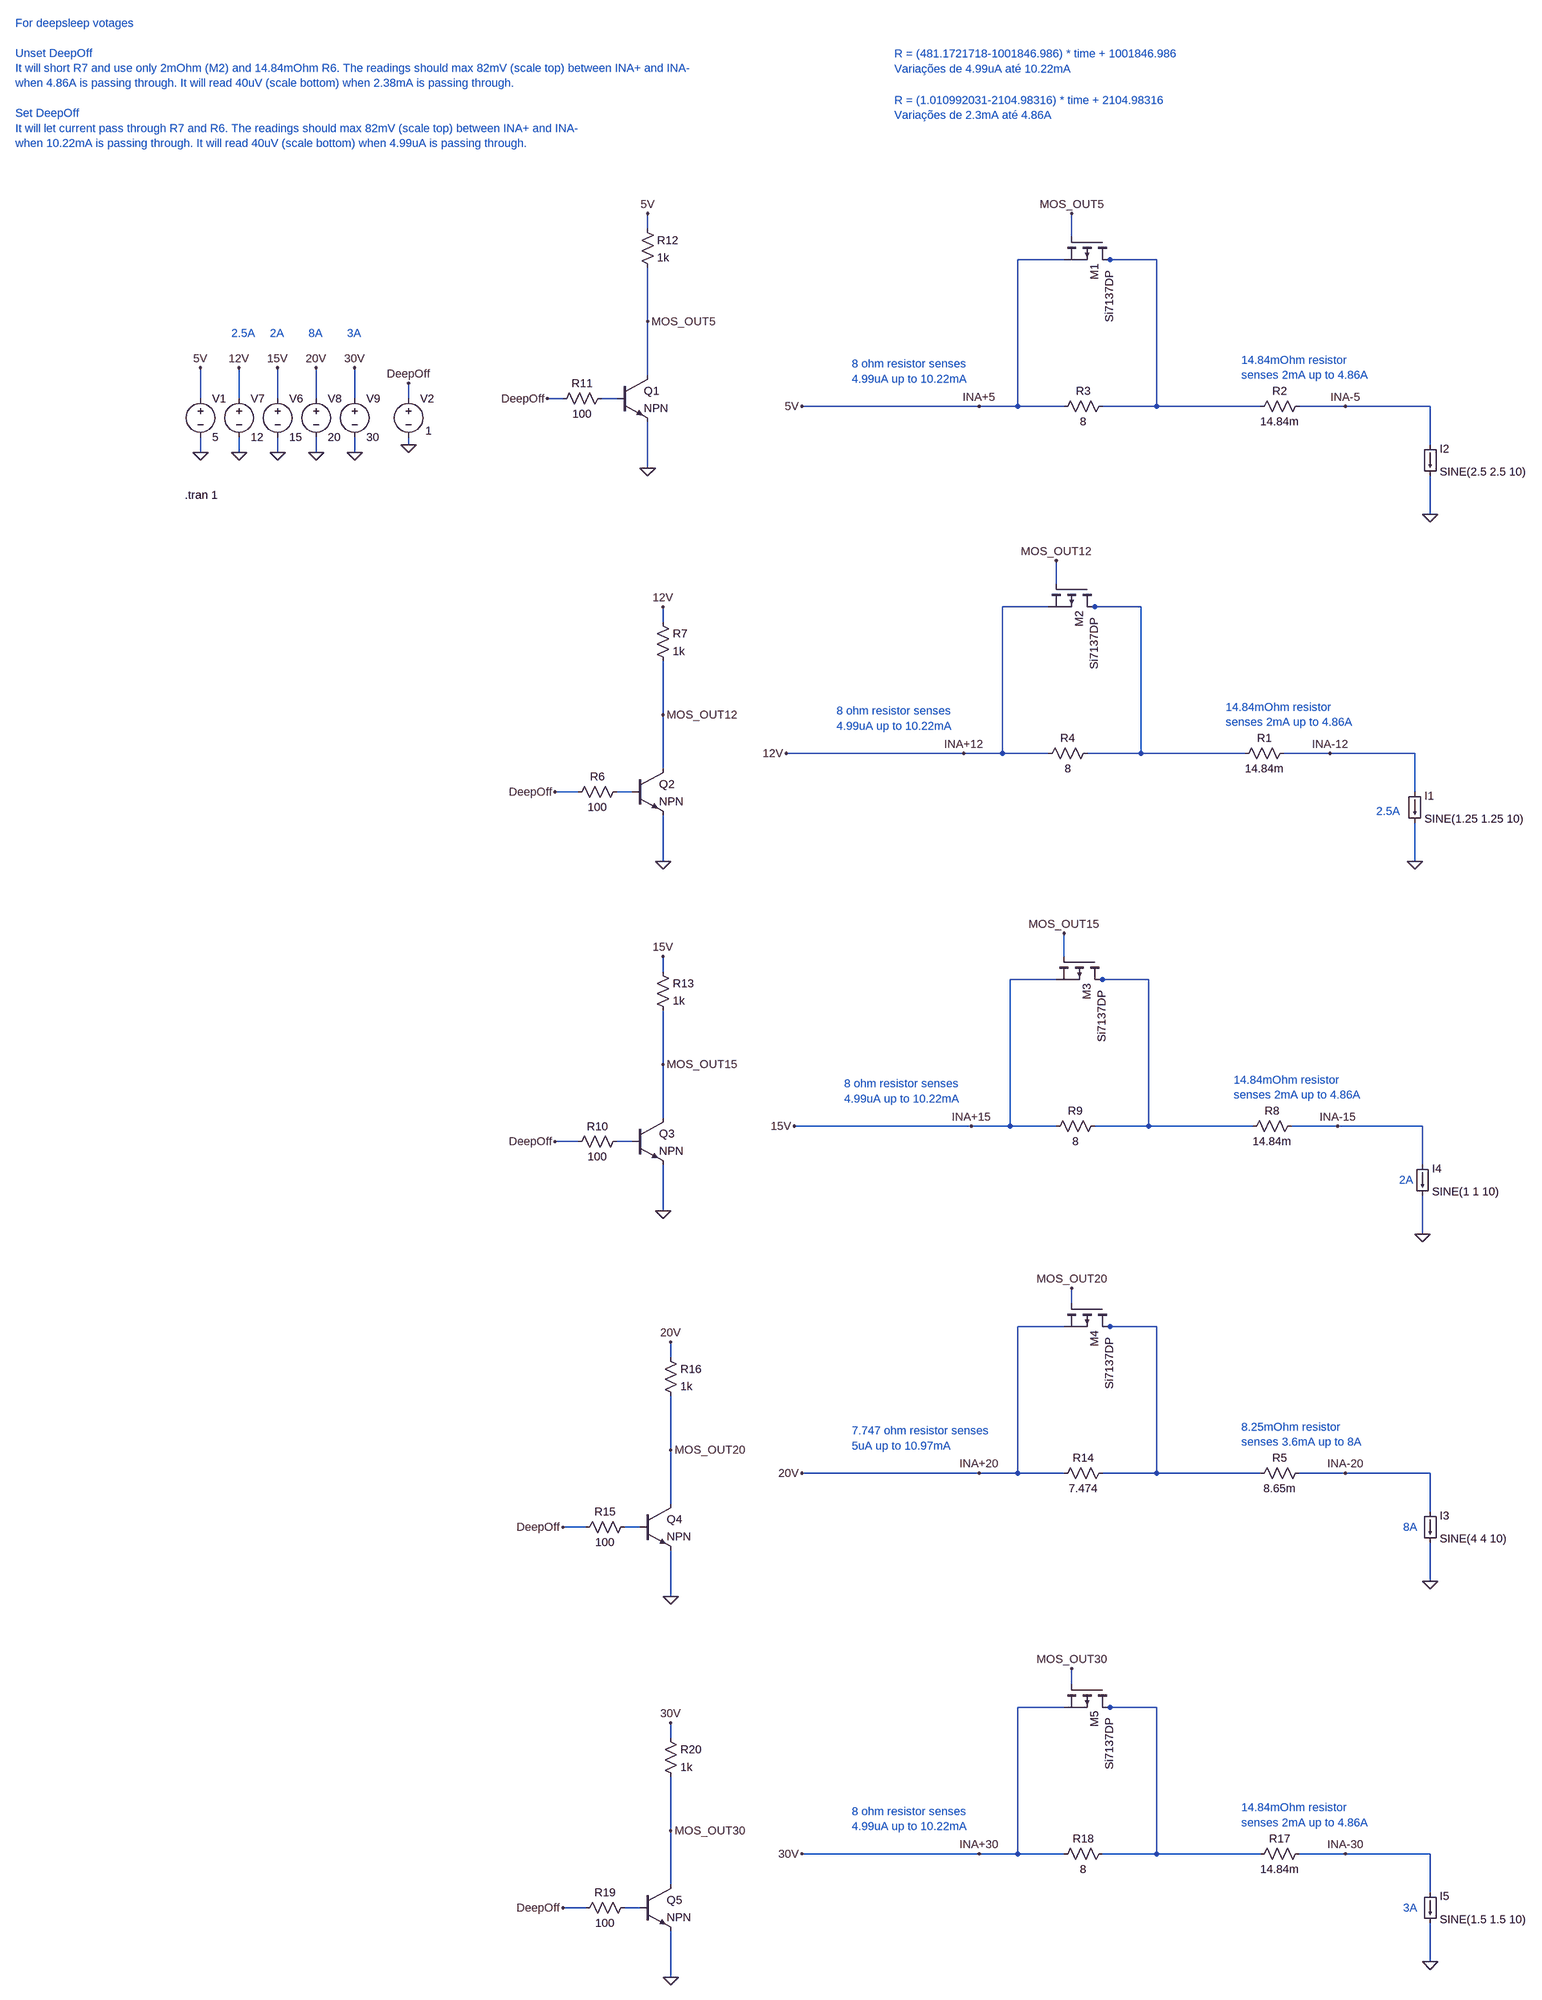
[diagram p0: schematic auto_ranging.asc]
auto_ranging.asc, the LTspice schematic file:
Version 4.1
SHEET 1 1712 4932
WIRE -1104 288 -1104 256
WIRE -224 304 -224 256
WIRE -240 352 -336 352
WIRE -144 352 -160 352
WIRE -48 352 -144 352
WIRE -1104 480 -1104 368
WIRE -1104 592 -1104 480
WIRE -2032 640 -2032 576
WIRE -1952 640 -1952 576
WIRE -1872 640 -1872 576
WIRE -1792 640 -1792 576
WIRE -1712 640 -1712 576
WIRE -1600 640 -1600 608
WIRE -1280 640 -1312 640
WIRE -1168 640 -1200 640
WIRE -416 656 -784 656
WIRE -336 656 -336 352
WIRE -336 656 -416 656
WIRE -240 656 -336 656
WIRE -48 656 -48 352
WIRE -48 656 -160 656
WIRE 208 656 -48 656
WIRE 384 656 288 656
WIRE 560 656 384 656
WIRE -1600 736 -1600 720
WIRE 560 736 560 656
WIRE -2032 752 -2032 720
WIRE -1952 752 -1952 720
WIRE -1872 752 -1872 720
WIRE -1792 752 -1792 720
WIRE -1712 752 -1712 720
WIRE -1104 784 -1104 688
WIRE 560 880 560 800
WIRE -256 1024 -256 976
WIRE -272 1072 -368 1072
WIRE -176 1072 -192 1072
WIRE -80 1072 -176 1072
WIRE -1072 1104 -1072 1072
WIRE -1072 1296 -1072 1184
WIRE -448 1376 -816 1376
WIRE -368 1376 -368 1072
WIRE -368 1376 -448 1376
WIRE -272 1376 -368 1376
WIRE -80 1376 -80 1072
WIRE -80 1376 -192 1376
WIRE 176 1376 -80 1376
WIRE 352 1376 256 1376
WIRE 528 1376 352 1376
WIRE -1072 1408 -1072 1296
WIRE -1248 1456 -1296 1456
WIRE -1136 1456 -1168 1456
WIRE 528 1456 528 1376
WIRE -1072 1600 -1072 1504
WIRE 528 1600 528 1520
WIRE -240 1824 -240 1776
WIRE -1072 1856 -1072 1824
WIRE -256 1872 -352 1872
WIRE -160 1872 -176 1872
WIRE -64 1872 -160 1872
WIRE -1072 2048 -1072 1936
WIRE -1072 2160 -1072 2048
WIRE -432 2176 -800 2176
WIRE -352 2176 -352 1872
WIRE -352 2176 -432 2176
WIRE -256 2176 -352 2176
WIRE -64 2176 -64 1872
WIRE -64 2176 -176 2176
WIRE 192 2176 -64 2176
WIRE 368 2176 272 2176
WIRE 544 2176 368 2176
WIRE -1248 2208 -1296 2208
WIRE -1136 2208 -1168 2208
WIRE 544 2256 544 2176
WIRE -1072 2352 -1072 2256
WIRE 544 2400 544 2320
WIRE -224 2544 -224 2512
WIRE -240 2592 -336 2592
WIRE -144 2592 -160 2592
WIRE -48 2592 -144 2592
WIRE -1056 2656 -1056 2624
WIRE -1056 2848 -1056 2736
WIRE -416 2896 -784 2896
WIRE -336 2896 -336 2592
WIRE -336 2896 -416 2896
WIRE -240 2896 -336 2896
WIRE -48 2896 -48 2592
WIRE -48 2896 -160 2896
WIRE 208 2896 -48 2896
WIRE 384 2896 288 2896
WIRE 560 2896 384 2896
WIRE -1056 2960 -1056 2848
WIRE 560 2976 560 2896
WIRE -1232 3008 -1280 3008
WIRE -1120 3008 -1152 3008
WIRE 560 3120 560 3040
WIRE -1056 3152 -1056 3056
WIRE -224 3392 -224 3360
WIRE -240 3440 -336 3440
WIRE -144 3440 -160 3440
WIRE -48 3440 -144 3440
WIRE -1056 3504 -1056 3472
WIRE -1056 3696 -1056 3584
WIRE -416 3744 -784 3744
WIRE -336 3744 -336 3440
WIRE -336 3744 -416 3744
WIRE -240 3744 -336 3744
WIRE -48 3744 -48 3440
WIRE -48 3744 -160 3744
WIRE 208 3744 -48 3744
WIRE 384 3744 288 3744
WIRE 560 3744 384 3744
WIRE -1056 3808 -1056 3696
WIRE 560 3824 560 3744
WIRE -1232 3856 -1280 3856
WIRE -1120 3856 -1152 3856
WIRE 560 3968 560 3888
WIRE -1056 4000 -1056 3904
FLAG -2032 752 0
FLAG -2032 576 5V
FLAG -1104 480 MOS_OUT5
FLAG -1600 608 DeepOff
FLAG -224 256 MOS_OUT5
FLAG -416 656 INA+5
FLAG 384 656 INA-5
FLAG 560 880 0
FLAG -1104 784 0
FLAG -1104 256 5V
FLAG -1600 736 0
FLAG -256 976 MOS_OUT12
FLAG -448 1376 INA+12
FLAG 352 1376 INA-12
FLAG 528 1600 0
FLAG -1872 752 0
FLAG -1872 576 15V
FLAG -1952 752 0
FLAG -1952 576 12V
FLAG -1792 752 0
FLAG -1792 576 20V
FLAG -1712 752 0
FLAG -1712 576 30V
FLAG -784 656 5V
FLAG -816 1376 12V
FLAG -1072 1296 MOS_OUT12
FLAG -1072 1600 0
FLAG -1312 640 DeepOff
FLAG -1296 1456 DeepOff
FLAG -1072 1072 12V
FLAG -432 2176 INA+15
FLAG 368 2176 INA-15
FLAG 544 2400 0
FLAG -1072 2048 MOS_OUT15
FLAG -1072 2352 0
FLAG -1296 2208 DeepOff
FLAG -1072 1824 15V
FLAG -240 1776 MOS_OUT15
FLAG -416 2896 INA+20
FLAG 384 2896 INA-20
FLAG 560 3120 0
FLAG -1056 2848 MOS_OUT20
FLAG -1056 3152 0
FLAG -1280 3008 DeepOff
FLAG -1056 2624 20V
FLAG -224 2512 MOS_OUT20
FLAG -416 3744 INA+30
FLAG 384 3744 INA-30
FLAG 560 3968 0
FLAG -1056 3696 MOS_OUT30
FLAG -1056 4000 0
FLAG -1280 3856 DeepOff
FLAG -224 3360 MOS_OUT30
FLAG -1056 3472 30V
FLAG -784 2896 20V
FLAG -800 2176 15V
FLAG -784 3744 30V
SYMBOL voltage -2032 624 R0
WINDOW 123 0 0 Left 0
WINDOW 39 0 0 Left 0
SYMATTR InstName V1
SYMATTR Value 5
SYMBOL npn -1168 592 R0
SYMATTR InstName Q1
SYMBOL res -1184 624 R90
WINDOW 0 0 56 VBottom 2
WINDOW 3 32 56 VTop 2
SYMATTR InstName R11
SYMATTR Value 100
SYMBOL res -1120 272 R0
SYMATTR InstName R12
SYMATTR Value 1k
SYMBOL voltage -1600 624 R0
WINDOW 3 35 83 Left 2
WINDOW 123 0 0 Left 0
WINDOW 39 0 0 Left 0
SYMATTR Value 1
SYMATTR InstName V2
SYMBOL res 192 672 R270
WINDOW 0 32 56 VTop 2
WINDOW 3 0 56 VBottom 2
SYMATTR InstName R2
SYMATTR Value 14.84m
SYMBOL res -256 672 R270
WINDOW 0 32 56 VTop 2
WINDOW 3 0 56 VBottom 2
SYMATTR InstName R3
SYMATTR Value 8
SYMBOL pmos -144 304 R90
WINDOW 3 70 1 Left 2
SYMATTR Value Si7137DP
SYMATTR InstName M1
SYMBOL load 544 736 R0
WINDOW 123 0 0 Left 0
WINDOW 39 0 0 Left 0
SYMATTR InstName I2
SYMATTR Value SINE(2.5 2.5 10)
SYMBOL res 160 1392 R270
WINDOW 0 32 56 VTop 2
WINDOW 3 0 56 VBottom 2
SYMATTR InstName R1
SYMATTR Value 14.84m
SYMBOL res -288 1392 R270
WINDOW 0 32 56 VTop 2
WINDOW 3 0 56 VBottom 2
SYMATTR InstName R4
SYMATTR Value 8
SYMBOL pmos -176 1024 R90
WINDOW 3 70 1 Left 2
SYMATTR Value Si7137DP
SYMATTR InstName M2
SYMBOL load 512 1456 R0
WINDOW 123 0 0 Left 0
WINDOW 39 0 0 Left 0
SYMATTR InstName I1
SYMATTR Value SINE(1.25 1.25 10)
SYMBOL voltage -1872 624 R0
WINDOW 123 0 0 Left 0
WINDOW 39 0 0 Left 0
SYMATTR InstName V6
SYMATTR Value 15
SYMBOL voltage -1952 624 R0
WINDOW 123 0 0 Left 0
WINDOW 39 0 0 Left 0
SYMATTR InstName V7
SYMATTR Value 12
SYMBOL voltage -1792 624 R0
WINDOW 123 0 0 Left 0
WINDOW 39 0 0 Left 0
SYMATTR InstName V8
SYMATTR Value 20
SYMBOL voltage -1712 624 R0
WINDOW 123 0 0 Left 0
WINDOW 39 0 0 Left 0
SYMATTR InstName V9
SYMATTR Value 30
SYMBOL npn -1136 1408 R0
SYMATTR InstName Q2
SYMBOL res -1152 1440 R90
WINDOW 0 0 56 VBottom 2
WINDOW 3 32 56 VTop 2
SYMATTR InstName R6
SYMATTR Value 100
SYMBOL res -1088 1088 R0
SYMATTR InstName R7
SYMATTR Value 1k
SYMBOL res 176 2192 R270
WINDOW 0 32 56 VTop 2
WINDOW 3 0 56 VBottom 2
SYMATTR InstName R8
SYMATTR Value 14.84m
SYMBOL res -272 2192 R270
WINDOW 0 32 56 VTop 2
WINDOW 3 0 56 VBottom 2
SYMATTR InstName R9
SYMATTR Value 8
SYMBOL pmos -160 1824 R90
WINDOW 3 70 1 Left 2
SYMATTR Value Si7137DP
SYMATTR InstName M3
SYMBOL load 528 2256 R0
WINDOW 123 0 0 Left 0
WINDOW 39 0 0 Left 0
SYMATTR InstName I4
SYMATTR Value SINE(1 1 10)
SYMBOL npn -1136 2160 R0
SYMATTR InstName Q3
SYMBOL res -1152 2192 R90
WINDOW 0 0 56 VBottom 2
WINDOW 3 32 56 VTop 2
SYMATTR InstName R10
SYMATTR Value 100
SYMBOL res -1088 1840 R0
SYMATTR InstName R13
SYMATTR Value 1k
SYMBOL res 192 2912 R270
WINDOW 0 32 56 VTop 2
WINDOW 3 0 56 VBottom 2
SYMATTR InstName R5
SYMATTR Value 8.65m
SYMBOL res -256 2912 R270
WINDOW 0 32 56 VTop 2
WINDOW 3 0 56 VBottom 2
SYMATTR InstName R14
SYMATTR Value 7.474
SYMBOL pmos -144 2544 R90
WINDOW 3 70 1 Left 2
SYMATTR Value Si7137DP
SYMATTR InstName M4
SYMBOL load 544 2976 R0
WINDOW 123 0 0 Left 0
WINDOW 39 0 0 Left 0
SYMATTR InstName I3
SYMATTR Value SINE(4 4 10)
SYMBOL npn -1120 2960 R0
SYMATTR InstName Q4
SYMBOL res -1136 2992 R90
WINDOW 0 0 56 VBottom 2
WINDOW 3 32 56 VTop 2
SYMATTR InstName R15
SYMATTR Value 100
SYMBOL res -1072 2640 R0
SYMATTR InstName R16
SYMATTR Value 1k
SYMBOL res 192 3760 R270
WINDOW 0 32 56 VTop 2
WINDOW 3 0 56 VBottom 2
SYMATTR InstName R17
SYMATTR Value 14.84m
SYMBOL res -256 3760 R270
WINDOW 0 32 56 VTop 2
WINDOW 3 0 56 VBottom 2
SYMATTR InstName R18
SYMATTR Value 8
SYMBOL pmos -144 3392 R90
WINDOW 3 70 1 Left 2
SYMATTR Value Si7137DP
SYMATTR InstName M5
SYMBOL load 544 3824 R0
WINDOW 123 0 0 Left 0
WINDOW 39 0 0 Left 0
SYMATTR InstName I5
SYMATTR Value SINE(1.5 1.5 10)
SYMBOL npn -1120 3808 R0
SYMATTR InstName Q5
SYMBOL res -1136 3840 R90
WINDOW 0 0 56 VBottom 2
WINDOW 3 32 56 VTop 2
SYMATTR InstName R19
SYMATTR Value 100
SYMBOL res -1072 3488 R0
SYMATTR InstName R20
SYMATTR Value 1k
TEXT -2064 840 Left 2 !.tran 1
TEXT -2416 -216 Left 2 ;For deepsleep votages\n \nUnset DeepOff\nIt will short R7 and use only 2mOhm (M2) and 14.84mOhm R6. The readings should max 82mV (scale top) between INA+ and INA-\nwhen 4.86A is passing through. It will read 40uV (scale bottom) when 2.38mA is passing through.\n \nSet DeepOff\nIt will let current pass through R7 and R6. The readings should max 82mV (scale top) between INA+ and INA-\nwhen 10.22mA is passing through. It will read 40uV (scale bottom) when 4.99uA is passing through.
TEXT -592 -152 Left 2 ;R = (481.1721718-1001846.986) * time + 1001846.986\nVariações de 4.99uA até 10.22mA
TEXT -592 -56 Left 2 ;R = (1.010992031-2104.98316) * time + 2104.98316\nVariações de 2.3mA até 4.86A
TEXT -680 568 Left 2 ;8 ohm resistor senses\n4.99uA up to 10.22mA
TEXT 168 560 Left 2 ;14.84mOhm resistor\nsenses 2mA up to 4.86A
TEXT -712 1288 Left 2 ;8 ohm resistor senses\n4.99uA up to 10.22mA
TEXT 136 1280 Left 2 ;14.84mOhm resistor\nsenses 2mA up to 4.86A
TEXT -1968 504 Left 2 ;2.5A
TEXT -1888 504 Left 2 ;2A
TEXT -1808 504 Left 2 ;8A
TEXT -1728 504 Left 2 ;3A
TEXT -696 2088 Left 2 ;8 ohm resistor senses\n4.99uA up to 10.22mA
TEXT 152 2080 Left 2 ;14.84mOhm resistor\nsenses 2mA up to 4.86A
TEXT -680 2808 Left 2 ;7.747 ohm resistor senses\n5uA up to 10.97mA
TEXT 168 2800 Left 2 ;8.25mOhm resistor\nsenses 3.6mA up to 8A
TEXT -680 3656 Left 2 ;8 ohm resistor senses\n4.99uA up to 10.22mA
TEXT 168 3648 Left 2 ;14.84mOhm resistor\nsenses 2mA up to 4.86A
TEXT 448 1496 Left 2 ;2.5A
TEXT 496 2288 Left 2 ;2A
TEXT 504 3008 Left 2 ;8A
TEXT 504 3856 Left 2 ;3A

The netlist it stands for:
* auto_ranging.asc
V1 INA+5 0 5
Q1 MOS_OUT5 N002 0 0 NPN
R11 N002 DeepOff 100
R12 INA+5 MOS_OUT5 1k
V2 DeepOff 0 1
R2 N001 INA-5 14.84m
R3 INA+5 N001 8
M1 N001 MOS_OUT5 INA+5 INA+5 Si7137DP
I2 INA-5 0 SINE(2.5 2.5 10)
R1 N003 INA-12 14.84m
R4 12V N003 8
M2 N003 MOS_OUT12 12V 12V Si7137DP
I1 INA-12 0 SINE(1.25 1.25 10)
V6 INA+15 0 15
V7 12V 0 12
V8 INA+20 0 20
V9 INA+30 0 30
Q2 MOS_OUT12 N004 0 0 NPN
R6 N004 DeepOff 100
R7 12V MOS_OUT12 1k
R8 N005 INA-15 14.84m
R9 INA+15 N005 8
M3 N005 MOS_OUT15 INA+15 INA+15 Si7137DP
I4 INA-15 0 SINE(1 1 10)
Q3 MOS_OUT15 N006 0 0 NPN
R10 N006 DeepOff 100
R13 INA+15 MOS_OUT15 1k
R5 N007 INA-20 8.65m
R14 INA+20 N007 7.474
M4 N007 MOS_OUT20 INA+20 INA+20 Si7137DP
I3 INA-20 0 SINE(4 4 10)
Q4 MOS_OUT20 N008 0 0 NPN
R15 N008 DeepOff 100
R16 INA+20 MOS_OUT20 1k
R17 N009 INA-30 14.84m
R18 INA+30 N009 8
M5 N009 MOS_OUT30 INA+30 INA+30 Si7137DP
I5 INA-30 0 SINE(1.5 1.5 10)
Q5 MOS_OUT30 N010 0 0 NPN
R19 N010 DeepOff 100
R20 INA+30 MOS_OUT30 1k
.model NPN NPN
.model PNP PNP
.lib standard.bjt
.model NMOS NMOS
.model PMOS PMOS
.lib standard.mos
.tran 1
* For deepsleep votages
* Unset DeepOff
* It will short R7 and use only 2mOhm (M2) and 14.84mOhm R6. The readings should max 82mV (scale top) between INA+ and INA-
* when 4.86A is passing through. It will read 40uV (scale bottom) when 2.38mA is passing through.
* Set DeepOff
* It will let current pass through R7 and R6. The readings should max 82mV (scale top) between INA+ and INA-
* when 10.22mA is passing through. It will read 40uV (scale bottom) when 4.99uA is passing through.
* R = (481.1721718-1001846.986) * time + 1001846.986
* Variações de 4.99uA até 10.22mA
* R = (1.010992031-2104.98316) * time + 2104.98316
* Variações de 2.3mA até 4.86A
* 8 ohm resistor senses
* 4.99uA up to 10.22mA
* 14.84mOhm resistor
* senses 2mA up to 4.86A
* 8 ohm resistor senses
* 4.99uA up to 10.22mA
* 14.84mOhm resistor
* senses 2mA up to 4.86A
* 2.5A
* 2A
* 8A
* 3A
* 8 ohm resistor senses
* 4.99uA up to 10.22mA
* 14.84mOhm resistor
* senses 2mA up to 4.86A
* 7.747 ohm resistor senses
* 5uA up to 10.97mA
* 8.25mOhm resistor
* senses 3.6mA up to 8A
* 8 ohm resistor senses
* 4.99uA up to 10.22mA
* 14.84mOhm resistor
* senses 2mA up to 4.86A
* 2.5A
* 2A
* 8A
* 3A
.backanno
.end